# Altium project 最小系统.PrjPCB
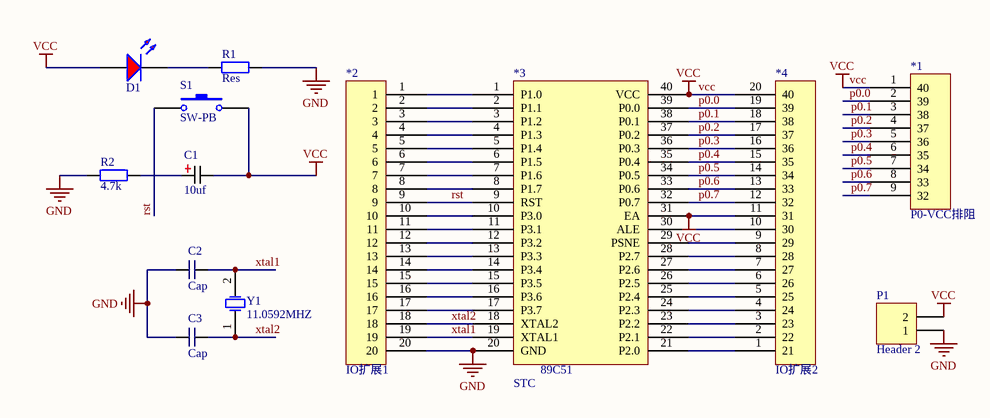
[diagram p0: 最小系统.SchDoc]
1 sheet, 13 parts. Net scope: global (net labels, ports and power ports of the same name join across sheets).
Board file: 最小系统1.PcbDoc

## Sheet 最小系统.SchDoc
size A4

### Parts
*1  P0-VCC排阻  [HDR1X8]
*2  IO扩展1  [HDR1X20]
*3  STC  [DIP403]
*4  IO扩展2  [HDR1X20]
C1  10uf  [CAPR2.54-5.1x3.2]
C2  Cap  [CAPR2.54-5.1x3.2]
C3  Cap  [CAPR2.54-5.1x3.2]
D1  LED0  [RAD-0.1]  (value not drawn)
P1  Header 2  [HDR1X2]
R1  Res  [AXIAL-0.4]
R2  4.7k  [AXIAL-0.4]
S1  SW-PB  [MHDR2X2]
Y1  11.0592MHZ  [CAPR2.54-5.1x3.2]

### Nets
GND: *2.20 *3.20(GND) C2.1 C3.1 P1.1 R1.2 R2.1
vcc: *1.1(40) *3.31(EA) *3.40(VCC) *4.11(31) *4.20(40) C1.2 D1.1(A) P1.2 S1.2
p0.0: *1.2(39) *3.39(P0.0) *4.19(39)
p0.1: *1.3(38) *3.38(P0.1) *4.18(38)
p0.2: *1.4(37) *3.37(P0.2) *4.17(37)
p0.3: *1.5(36) *3.36(P0.3) *4.16(36)
p0.4: *1.6(35) *3.35(P0.4) *4.15(35)
p0.5: *1.7(34) *3.34(P0.5) *4.14(34)
p0.6: *1.8(33) *3.33(P0.6) *4.13(33)
p0.7: *1.9(32) *3.32(P0.7) *4.12(32)
rst: *2.9 *3.9(RST) S1.1
xtal1: *2.19 *3.19(XTAL1) C2.2 Y1.2(OSC2)
xtal2: *2.18 *3.18(XTAL2) C3.2 Y1.1(OSC1)
Net*2_1: *2.1 *3.1(P1.0)
Net*2_2: *2.2 *3.2(P1.1)
Net*2_3: *2.3 *3.3(P1.2)
Net*2_4: *2.4 *3.4(P1.3)
Net*2_5: *2.5 *3.5(P1.4)
Net*2_6: *2.6 *3.6(P1.5)
Net*2_7: *2.7 *3.7(P1.6)
Net*2_8: *2.8 *3.8(P1.7)
Net*2_10: *2.10 *3.10(P3.0)
Net*2_11: *2.11 *3.11(P3.1)
Net*2_12: *2.12 *3.12(P3.2)
Net*2_13: *2.13 *3.13(P3.3)
Net*2_14: *2.14 *3.14(P3.4)
Net*2_15: *2.15 *3.15(P3.5)
Net*2_16: *2.16 *3.16(P3.6)
Net*2_17: *2.17 *3.17(P3.7)
Net*3_21: *3.21(P2.0) *4.1(21)
Net*3_22: *3.22(P2.1) *4.2(22)
Net*3_23: *3.23(P2.2) *4.3(23)
Net*3_24: *3.24(P2.3) *4.4(24)
Net*3_25: *3.25(P2.4) *4.5(25)
Net*3_26: *3.26(P2.5) *4.6(26)
Net*3_27: *3.27(P2.6) *4.7(27)
Net*3_28: *3.28(P2.7) *4.8(28)
Net*3_29: *3.29(PSNE) *4.9(29)
Net*3_30: *3.30(ALE) *4.10(30)
NetC1_1: C1.1 R2.2
NetD1_2: D1.2(K) R1.1

### Notes on the sheet
- (in symbol STC) 89C51

### Library data of the parts
C1 = Cap Pol
P1 = Header 2: Header, 2-Pin; LatestRevisionDate: 17-Jul-2002; LatestRevisionNote: Re-released for DXP Platform.; Publisher: Altium Limited
R1 = Res: Resistor; Value: 1K; Published: 8-Jun-2000; LatestRevisionDate: 17-Jul-2002; LatestRevisionNote: Re-released for DXP Platform.; PackageReference: AXIAL-0.4; Publisher: Altium Limited
R2 = Res2: Value: 1K; Published: 8-Jun-2000; LatestRevisionDate: 17-Jul-2002; LatestRevisionNote: Re-released for DXP Platform.; PackageReference: AXIAL-0.4; Publisher: Altium Limited
S1 = SW-PB: Switch; Published: 24-Mar-1999; LatestRevisionDate: 17-Jul-2002; LatestRevisionNote: Re-released for DXP Platform.; PackageReference: SPST-2; Publisher: Altium Limited
Y1 = XTAL: Crystal Oscillator; Published: 8-Jun-2000; LatestRevisionDate: 17-Jul-2002; LatestRevisionNote: Re-released for DXP Platform.; PackageReference: R38; Publisher: Altium Limited
D1 = LED0: Published: 8-Jun-2000; LatestRevisionDate: 08-Jul-2005; LatestRevisionNote: Mech Layer 1 removed.; PackageReference: LED-0; Publisher: Altium Limited